# EAGLE design 5Hz_Protoshield_v11 (EAGLE 6.2)
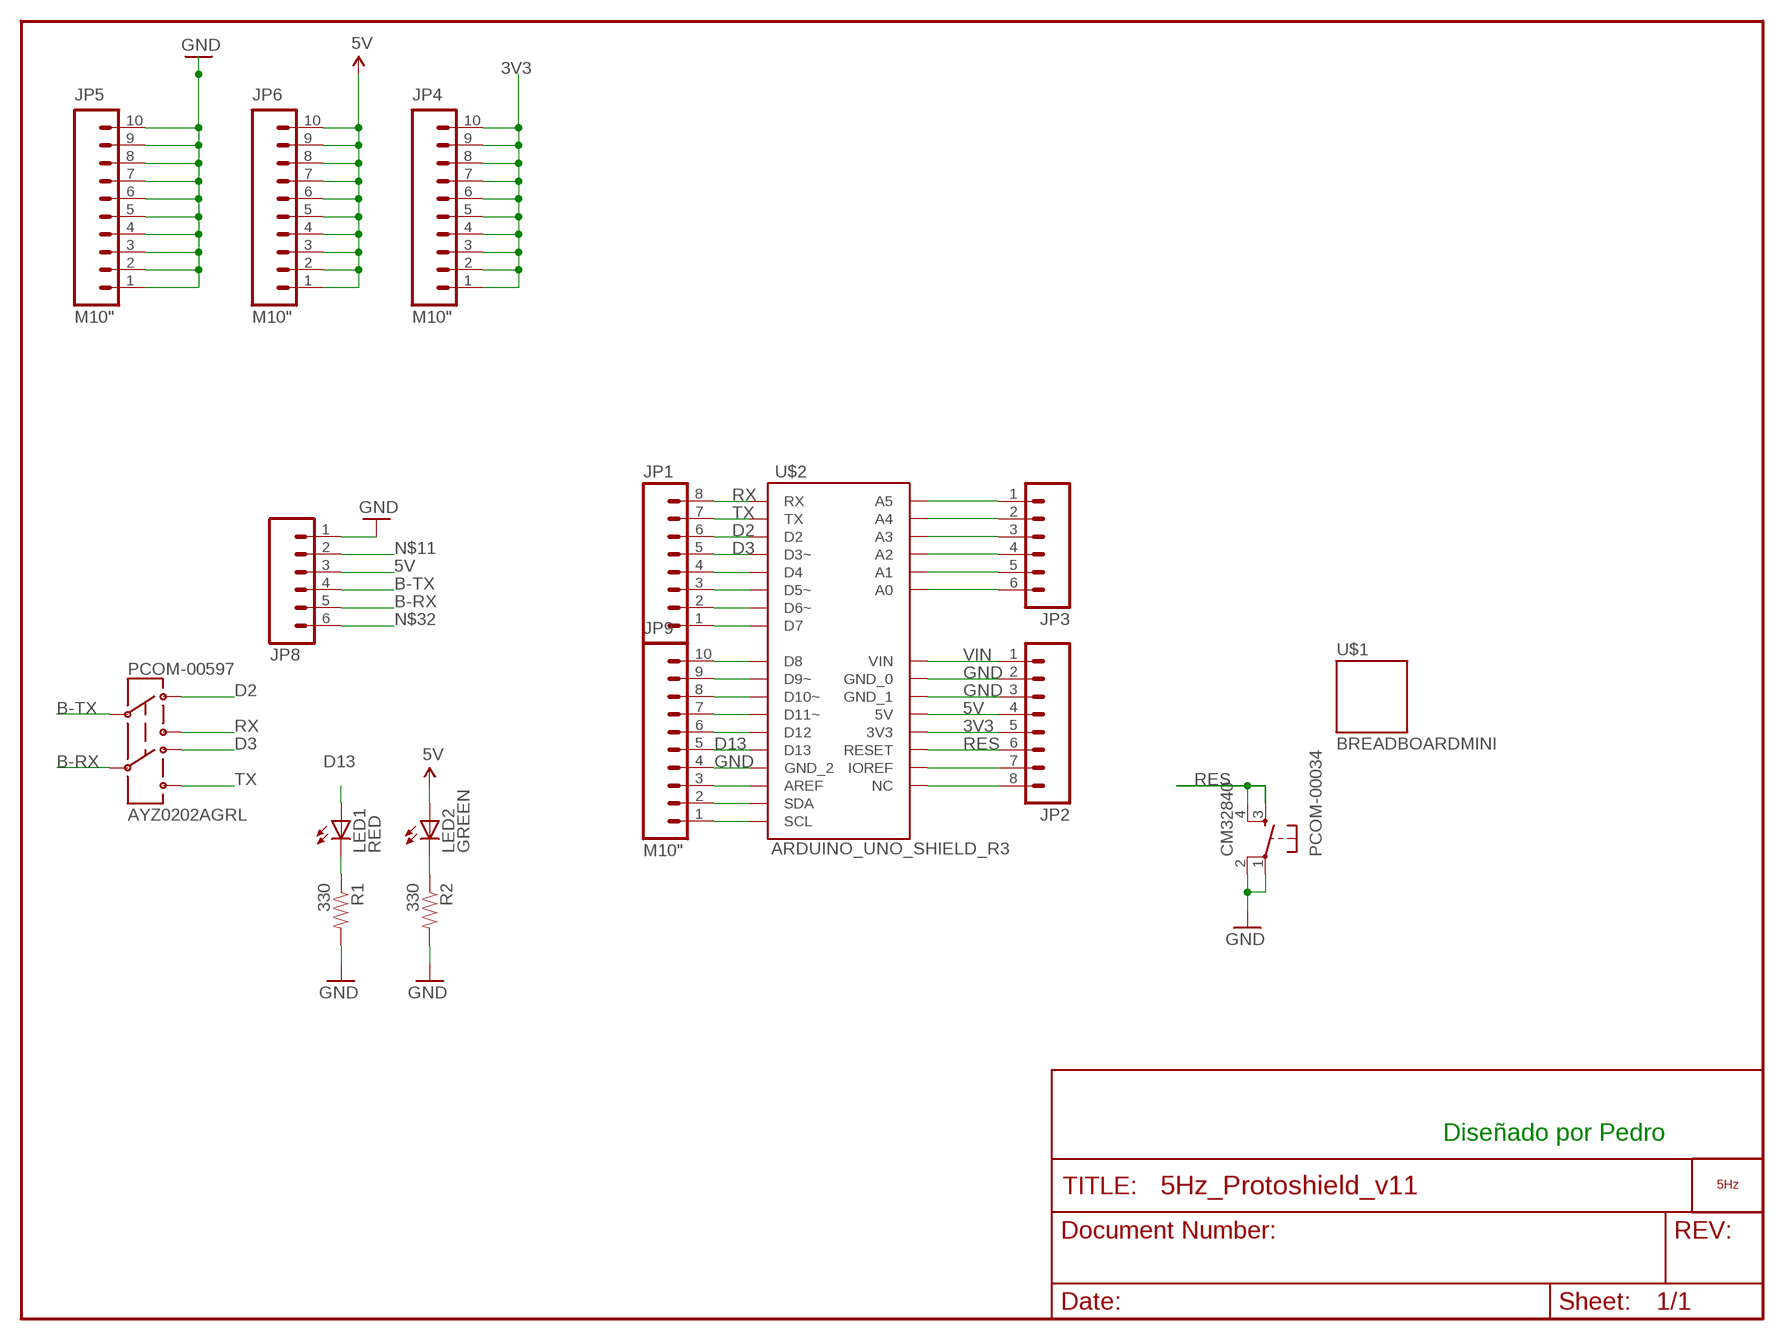
[diagram p0: schematic, sheet 1]

## Parts
JP1  M081X08  [1X08]
JP2  M081X08  [1X08]
JP3  M06SIP  [1X06]
JP4  M10"  [1X10]
JP5  M10"  [1X10]
JP6  M10"  [1X10]
JP8  M06SIP  [1X06]
JP9  M10"  [1X10]
LED1  RED  LED0603  [LED-0603]
LED2  GREEN  LED0603  [LED-0603]
LOGO1  LOGO_5HZ_H_10MM  [5HZ_LOGO_H_10MM]
PCOM-00034  CM32840  TAC_SWITCHSMD  [TACTILE_SWITCH_SMD]
PCOM-00597  AYZ0202AGRL  SWITCH-DPDTSMD  [AYZ0202]
R1  330  RESISTOR0603-RES  [0603-RES]
R2  330  RESISTOR0603-RES  [0603-RES]
U$1  BREADBOARDMINI  [BREADBOARD-MINI]
U$2  ARDUINO_UNO_SHIELD_R3  [UNO_R3_SHIELD_NO_SILK]

## Nets
3V3: JP2.5 JP4.1 JP4.2 JP4.3 JP4.4 JP4.5 JP4.6 JP4.7 JP4.8 JP4.9 JP4.10 U$2.3.3V(3V3)
5V: JP2.4 JP6.1 JP6.2 JP6.3 JP6.4 JP6.5 JP6.6 JP6.7 JP6.8 JP6.9 JP6.10 JP8.3 LED2.A U$2.5V
B-RX: JP8.5 PCOM-00597.5
B-TX: JP8.4 PCOM-00597.2
D2: JP1.6 PCOM-00597.1 U$2.D2
D3: JP1.5 PCOM-00597.4 U$2.D3(D3~)
D13: JP9.5 LED1.A U$2.D13
GND: JP2.2 JP2.3 JP5.1 JP5.2 JP5.3 JP5.4 JP5.5 JP5.6 JP5.7 JP5.8 JP5.9 JP5.10 JP8.1 JP9.4 PCOM-00034.1 PCOM-00034.2 R1.2 R2.2 U$2.GND_0 U$2.GND_1 U$2.GND_2
N$1: JP1.1 U$2.D7
N$2: JP1.2 U$2.D6(D6~)
N$3: JP1.3 U$2.D5(D5~)
N$4: JP1.4 U$2.D4
N$9: JP9.3 U$2.AREF
N$10: LED1.C R1.1
N$11: JP8.2
N$12: JP9.6 U$2.D12
N$13: JP9.7 U$2.D11(D11~)
N$14: JP9.8 U$2.D10(D10~)
N$15: JP9.9 U$2.D9(D9~)
N$16: JP9.10 U$2.D8
N$17: JP3.1 U$2.A5
N$18: JP3.2 U$2.A4
N$19: JP3.3 U$2.A3
N$20: JP3.4 U$2.A2
N$21: JP3.5 U$2.A1
N$22: JP3.6 U$2.A0
N$24: JP9.2 U$2.SDA
N$27: LED2.C R2.1
N$32: JP8.6
N$277: JP9.1 U$2.SCL
N$283: JP2.7 U$2.IOREF
N$284: JP2.8 U$2.NC
RES: JP2.6 PCOM-00034.3 PCOM-00034.4 U$2.RES(RESET)
RX: JP1.8 PCOM-00597.3 U$2.RX
TX: JP1.7 PCOM-00597.6 U$2.TX
VIN: JP2.1 U$2.VIN

## Notes on the sheet
- Diseñado por Pedro

## Library data of the parts
JP1 JP2 = SparkFun:M08: Header 8 Standard 8-pin 0.1" header. Use with straight break away headers (SKU : PRT-00116), right angle break away headers (PRT-00553), swiss pins (PRT-00743), machine pins (PRT-00117), and female headers (PRT-00115).
JP3 JP8 = SparkFun:M06: Header 6 Standard 6-pin 0.1" header. Use with straight break away headers (SKU : PRT-00116), right angle break away headers (PRT-00553), swiss pins (PRT-00743), machine pins (PRT-00117), and female headers (PRT-00115). Molex polarized connector foot print use with SKU : PRT-08094 with associated crimp pins and housings. NOTES ON THE VARIANTS LOCK and LOCK_LONGPADS... This footprint was designed to help hold the alignment of a through-hole component (i.e. 6-pin header) while soldering it into place. You may notice that each hole has been shifted either up or down by 0.005 of an inch from it's more standard position (which is a perfectly straight line). This slight alteration caused the pins (the squares in the middle) to touch the edges of the holes. Because they are alternating, it causes a "brace" to hold the component in place. 0.005 has proven to be the perfect amount of "off-center" position when using our standard breakaway headers. Although looks a little odd when you look at the bare footprint, once you have a header in there, the alteration is very hard to notice. Also, if you push a header all the way into place, it is covered up entirely on the bottom side. This idea of altering the position of holes to aid alignment will be further integrated into the Sparkfun Library for other footprints. It can help hold any component with 3 or more connection pins.
JP4-JP6 JP9 = SparkFun:M10: Header 10 Standard 10-pin 0.1" header. Use with straight break away headers (SKU : PRT-00116), right angle break away headers (PRT-00553), swiss pins (PRT-00743), machine pins (PRT-00117), and female headers (PRT-00115).
LED1 LED2 = SparkFun:LED: LEDs Standard schematic elements and footprints for 5mm, 3mm, 1206, and 0603 sized LEDs. 5mm - Spark Fun Electronics SKU : COM-00529 (and others)
LOGO1 = 5hz-electronica:LOGO_5HZ: Logotipo 5Hz "según Pedro"
PCOM-00034 = SparkFun:TAC_SWITCH: Momentary Switch Button commonly used for reset or general input. Spark Fun Electronics SKU : COM-00097
PCOM-00597 = SparkFun:SWITCH-DPDT: DPDT Version of the COM-00597
R1 R2 = SparkFun:RESISTOR: Resistor Basic schematic elements and footprints for 0603, 1206, and PTH resistors.
U$1 = SparkFun:BREADBOARD: Breadboard Mini Self Adhesive This is the mechnical outline for the very small self adhesive breadboard from SparkFun Electronics. Good for very small proto areas. SKU : PRT-07916
U$2 = 5hz-electronica:ARDUINO_UNO_SHIELD_R3

## Board
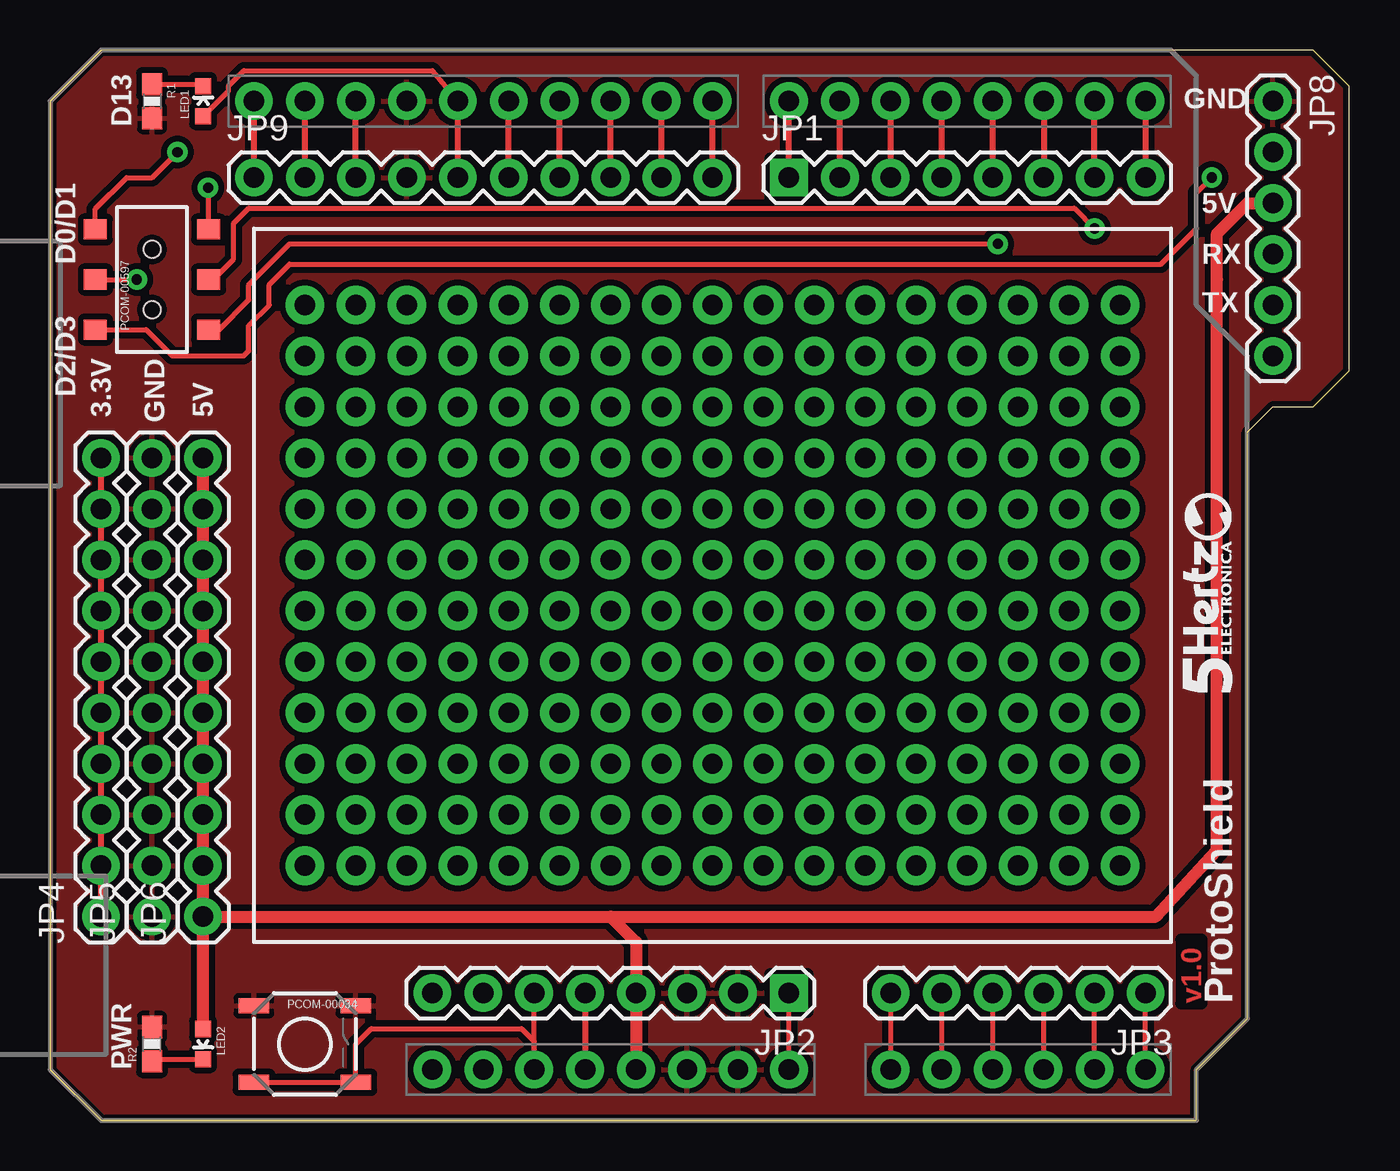
[diagram p1: board, top side]
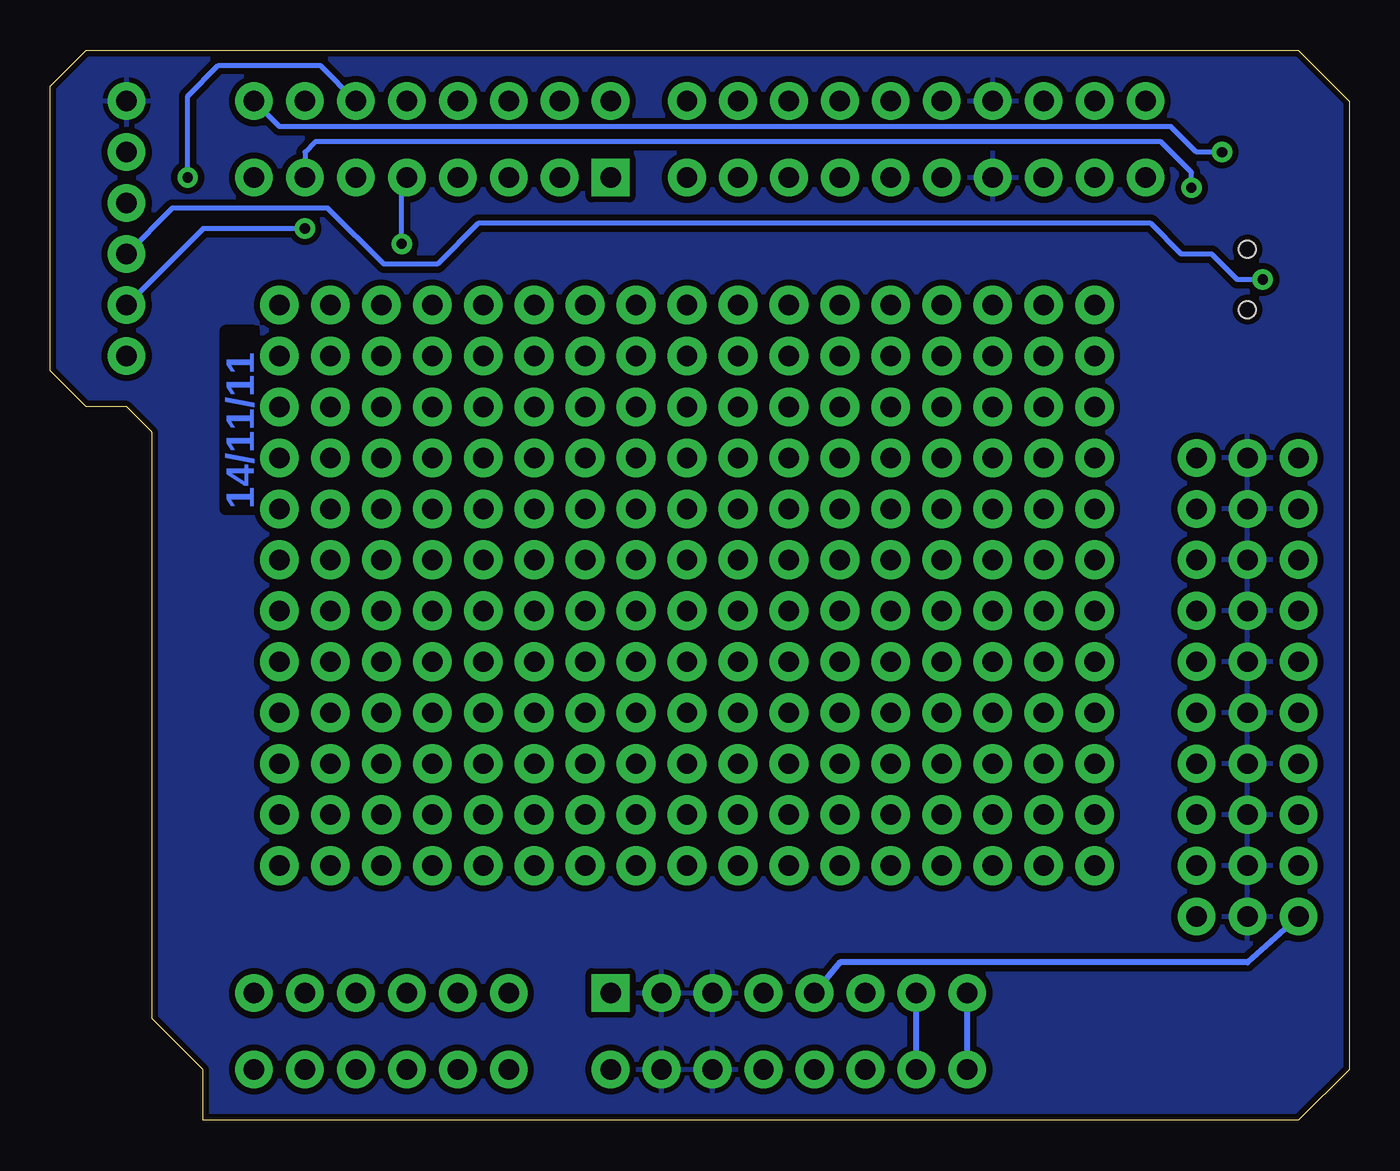
[diagram p2: board, bottom side, seen from below]

Size 64.77 x 53.34 mm. Coordinates in mm from the lower left corner, seen from the top.
Outline: 2.54,0 57.13,0 57.15,2.54 59.69,5.08 59.69,34.29 60.96,35.56 62.97,35.56 64.77,37.36 64.77,51.54 62.97,53.34 2.54,53.34 0,50.8 0,2.54 2.54,0
Copper layers (1*16): Top 0.035mm / dielectric 1.5mm / Bottom 0.035mm
Design rules: minimum track width 8mil, minimum drill 20mil, track to track 8mil, track to pad 8mil, pad to pad 8mil, via to via 8mil, smd to smd 8mil, copper to edge 10mil, drill to drill 8mil, minimum pad ring 12mil, minimum via ring 10mil, stop-mask expansion 4mil, vias tented up to drill 25mil, thermal gap 10mil

### Footprints (pad centres in the part's own frame; a part is rotated, then mirrored left to right if it is on the bottom)
1X08 = drill 1.016 pad 1.88 square: 1 0,0 | drill 1.016 pad 1.88: 2 2.54,0; 3 5.08,0; 4 7.62,0; 5 10.16,0; 6 12.7,0; 7 15.24,0; 8 17.78,0
1X06 = drill 1.016 pad 1.88: 1 0,0; 2 2.54,0; 3 5.08,0; 4 7.62,0; 5 10.16,0; 6 12.7,0
1X10 = drill 1.016 pad 1.88: 1 0,0; 2 2.54,0; 3 5.08,0; 4 7.62,0; 5 10.16,0; 6 12.7,0; 7 15.24,0; 8 17.78,0; 9 20.32,0; 10 22.86,0
LED-0603 = smd 0.8 x 0.8: A 0,-0.75; C 0,0.75
TACTILE_SWITCH_SMD = smd 1.524 x 0.762: 1 -2.54,1.905; 2 2.54,1.905; 3 -2.54,-1.905; 4 2.54,-1.905
AYZ0202 = smd 1 x 1.15: 1 -2.5,2.825; 2 0,2.825; 3 2.5,2.825; 4 -2.5,-2.825; 5 0,-2.825; 6 2.5,-2.825 | hole 0.85: 1.5,0; -1.5,0
0603-RES = smd 1.1 x 1: 1 -0.85,0; 2 0.85,0
UNO_R3_SHIELD_NO_SILK = drill 1.016 pad 1.88: 3.3V 26.67,2.54; 5V 29.21,2.54; A0 41.91,2.54; A1 44.45,2.54; A2 46.99,2.54; A3 49.53,2.54; A4 52.07,2.54; A5 54.61,2.54; AREF 15.24,50.8; D2 49.53,50.8; D3 46.99,50.8; D4 44.45,50.8; D5 41.91,50.8; D6 39.37,50.8; D7 36.83,50.8; D8 33.02,50.8; D9 30.48,50.8; D10 27.94,50.8; D11 25.4,50.8; D12 22.86,50.8; D13 20.32,50.8; GND_0 34.29,2.54; GND_1 31.75,2.54; GND_2 17.78,50.8; IOREF 21.59,2.54; NC 19.05,2.54; RES 24.13,2.54; RX 54.61,50.8; SCL 10.16,50.8; SDA 12.7,50.8; TX 52.07,50.8; VIN 36.83,2.54

### Placement (x,y rotation side)
JP1  36.83,46.99 0 top
JP2  36.83,6.35 180 top
JP3  54.61,6.35 180 top
JP4  2.54,10.16 90 top
JP5  5.08,10.16 90 top
JP6  7.62,10.16 90 top
JP8  60.96,50.8 270 top
JP9  10.16,46.99 0 top
LED1  7.62,50.8 0 top
LED2  7.62,3.81 180 top
LOGO1  58.93,21.34 90 top
PCOM-00034  12.7,3.81 0 top
PCOM-00597  5.08,41.91 90 top
R1  5.08,50.8 270 top
R2  5.08,3.81 90 top
U$1  10.16,8.89 0 top
U$2  0,0 0 top

### Tracks (layer width: path | path; a pad name or v marks a point on that pad's centre or on a via)
3V3
  Top 0.305: JP4.10 JP4.9 JP4.8 JP4.7 JP4.6 JP4.5 JP4.4 JP4.3 JP4.2 JP4.1 | JP2.5 U$2.3.3V
  Bottom 0.305: JP4.1 5.08,7.87 25.4,7.87 JP2.5
5V
  Top 0.61: LED2.A JP6.1 | JP6.1 JP6.2 JP6.3 JP6.4 JP6.5 JP6.6 JP6.7 JP6.8 JP6.9 JP6.10 | 27.94,10.16 29.21,8.89 JP2.4 U$2.5V | JP6.1 27.94,10.16 | 27.94,10.16 55.12,10.16 58.17,13.46 58.17,41.91 58.17,44.2 59.69,45.72 JP8.3
B-RX  (via drill 0.51)
  Top 0.254: PCOM-00597.5 8.13,41.91 9.14,42.93 9.14,44.7 9.91,45.47 51.05,45.47 v52.07,44.45
  Bottom 0.254: v52.07,44.45 57.15,44.45 JP8.5
B-TX  (via drill 0.51)
  Top 0.254: PCOM-00597.2 v4.32,41.91
  Bottom 0.254: v4.32,41.91 5.59,41.91 6.86,43.18 8.38,43.18 9.91,44.7 43.43,44.7 45.47,42.67 48.13,42.67 50.93,45.47 58.67,45.47 JP8.4
D2  (via drill 0.51)
  Top 0.254: PCOM-00597.1 4.79,39.41 6.1,38.1 9.65,38.1 9.91,38.35 9.91,39.62 10.92,40.64 10.92,41.66 11.94,42.67 55.37,42.67 57.15,44.45 57.15,46.23 v57.91,46.99
  Top 0.305: U$2.D2 JP1.6
  Bottom 0.254: v57.91,46.99 57.91,51.05 56.39,52.58 51.31,52.58 U$2.D2
D3  (via drill 0.51)
  Top 0.254: PCOM-00597.4 8.42,39.41 9.91,40.89 9.91,41.66 11.94,43.69 v47.24,43.69
  Top 0.305: JP1.5 U$2.D3
  Bottom 0.254: v47.24,43.69 47.24,46.74 JP1.5
D13
  Top 0.254: 7.62,50.29 LED1.A 8.37,50.8 8.38,50.8 8.89,51.31 8.89,51.56 9.65,52.32 19.05,52.32 U$2.D13
  Top 0.305: U$2.D13 JP9.5
GND
  pour Bottom (isolate 0.305): 0,50.8 0,2.54 2.54,0 57.15,0 57.15,2.54 59.69,5.08 59.69,34.29 60.96,35.56 62.97,35.56 64.77,37.36 64.77,51.54 62.97,53.34 2.54,53.34
  pour Top (isolate 0.305): 0,50.8 0,2.54 2.54,0 57.15,0 57.15,2.54 59.69,5.08 59.69,34.29 60.96,35.56 62.97,35.56 64.77,37.36 64.77,51.54 62.97,53.34 2.54,53.34
N$1
  Top 0.305: JP1.1 U$2.D7
N$2
  Top 0.305: JP1.2 U$2.D6
N$3
  Top 0.305: JP1.3 U$2.D5
N$4
  Top 0.305: JP1.4 U$2.D4
N$9
  Top 0.305: JP9.3 U$2.AREF
N$10
  Top 0.254: R1.1 7.52,51.65 LED1.C
N$12
  Top 0.305: JP9.6 U$2.D12
N$13
  Top 0.305: JP9.7 U$2.D11
N$14
  Top 0.305: JP9.8 U$2.D10
N$15
  Top 0.305: JP9.9 U$2.D9
N$16
  Top 0.305: JP9.10 U$2.D8
N$17
  Top 0.254: U$2.A5 JP3.1
N$18
  Top 0.254: U$2.A4 JP3.2
N$19
  Top 0.254: U$2.A3 JP3.3
N$20
  Top 0.254: U$2.A2 JP3.4
N$21
  Top 0.254: U$2.A1 JP3.5
N$22
  Top 0.254: U$2.A0 JP3.6
N$23  (via drill 1.02 pad 1.93)
  other vias: 20.32,40.64
N$24
  Top 0.305: JP9.2 U$2.SDA
N$25  (via drill 1.02 pad 1.93)
  other vias: 20.32,38.1
N$26  (via drill 1.02 pad 1.93)
  other vias: 20.32,35.56
N$27
  Top 0.254: R2.1 5.18,3.06 LED2.C
N$28  (via drill 1.02 pad 1.93)
  other vias: 20.32,33.02
N$77  (via drill 1.02 pad 1.93)
  other vias: 53.34,40.64
N$78  (via drill 1.02 pad 1.93)
  other vias: 53.34,38.1
N$79  (via drill 1.02 pad 1.93)
  other vias: 53.34,35.56
N$80  (via drill 1.02 pad 1.93)
  other vias: 53.34,33.02
N$81  (via drill 1.02 pad 1.93)
  other vias: 53.34,30.48
N$82  (via drill 1.02 pad 1.93)
  other vias: 53.34,27.94
N$83  (via drill 1.02 pad 1.93)
  other vias: 53.34,25.4
N$84  (via drill 1.02 pad 1.93)
  other vias: 53.34,22.86
N$85  (via drill 1.02 pad 1.93)
  other vias: 53.34,20.32
N$86  (via drill 1.02 pad 1.93)
  other vias: 53.34,17.78
N$87  (via drill 1.02 pad 1.93)
  other vias: 53.34,15.24
N$88  (via drill 1.02 pad 1.93)
  other vias: 53.34,12.7
N$89  (via drill 1.02 pad 1.93)
  other vias: 50.8,40.64
N$90  (via drill 1.02 pad 1.93)
  other vias: 50.8,38.1
N$91  (via drill 1.02 pad 1.93)
  other vias: 50.8,35.56
N$92  (via drill 1.02 pad 1.93)
  other vias: 50.8,33.02
N$93  (via drill 1.02 pad 1.93)
  other vias: 50.8,30.48
N$94  (via drill 1.02 pad 1.93)
  other vias: 50.8,27.94
N$95  (via drill 1.02 pad 1.93)
  other vias: 50.8,25.4
N$96  (via drill 1.02 pad 1.93)
  other vias: 50.8,22.86
N$97  (via drill 1.02 pad 1.93)
  other vias: 50.8,20.32
N$98  (via drill 1.02 pad 1.93)
  other vias: 50.8,17.78
N$99  (via drill 1.02 pad 1.93)
  other vias: 50.8,15.24
N$100  (via drill 1.02 pad 1.93)
  other vias: 50.8,12.7
N$101  (via drill 1.02 pad 1.93)
  other vias: 48.26,40.64
N$102  (via drill 1.02 pad 1.93)
  other vias: 48.26,38.1
N$103  (via drill 1.02 pad 1.93)
  other vias: 48.26,35.56
N$104  (via drill 1.02 pad 1.93)
  other vias: 48.26,33.02
N$105  (via drill 1.02 pad 1.93)
  other vias: 48.26,30.48
N$106  (via drill 1.02 pad 1.93)
  other vias: 48.26,27.94
N$107  (via drill 1.02 pad 1.93)
  other vias: 48.26,25.4
N$108  (via drill 1.02 pad 1.93)
  other vias: 48.26,22.86
N$109  (via drill 1.02 pad 1.93)
  other vias: 48.26,20.32
N$110  (via drill 1.02 pad 1.93)
  other vias: 48.26,17.78
N$111  (via drill 1.02 pad 1.93)
  other vias: 48.26,15.24
N$112  (via drill 1.02 pad 1.93)
  other vias: 48.26,12.7
N$113  (via drill 1.02 pad 1.93)
  other vias: 45.72,40.64
N$114  (via drill 1.02 pad 1.93)
  other vias: 45.72,38.1
N$115  (via drill 1.02 pad 1.93)
  other vias: 45.72,35.56
N$116  (via drill 1.02 pad 1.93)
  other vias: 45.72,33.02
N$117  (via drill 1.02 pad 1.93)
  other vias: 45.72,30.48
N$118  (via drill 1.02 pad 1.93)
  other vias: 45.72,27.94
N$119  (via drill 1.02 pad 1.93)
  other vias: 45.72,25.4
N$120  (via drill 1.02 pad 1.93)
  other vias: 45.72,22.86
N$121  (via drill 1.02 pad 1.93)
  other vias: 45.72,20.32
N$122  (via drill 1.02 pad 1.93)
  other vias: 45.72,17.78
N$123  (via drill 1.02 pad 1.93)
  other vias: 45.72,15.24
N$124  (via drill 1.02 pad 1.93)
  other vias: 45.72,12.7
N$125  (via drill 1.02 pad 1.93)
  other vias: 43.18,40.64
N$126  (via drill 1.02 pad 1.93)
  other vias: 43.18,38.1
N$127  (via drill 1.02 pad 1.93)
  other vias: 43.18,35.56
N$128  (via drill 1.02 pad 1.93)
  other vias: 43.18,33.02
N$129  (via drill 1.02 pad 1.93)
  other vias: 43.18,30.48
N$130  (via drill 1.02 pad 1.93)
  other vias: 43.18,27.94
N$131  (via drill 1.02 pad 1.93)
  other vias: 43.18,25.4
N$132  (via drill 1.02 pad 1.93)
  other vias: 43.18,22.86
N$133  (via drill 1.02 pad 1.93)
  other vias: 43.18,20.32
N$134  (via drill 1.02 pad 1.93)
  other vias: 43.18,17.78
N$135  (via drill 1.02 pad 1.93)
  other vias: 43.18,15.24
N$136  (via drill 1.02 pad 1.93)
  other vias: 43.18,12.7
N$137  (via drill 1.02 pad 1.93)
  other vias: 40.64,40.64
N$138  (via drill 1.02 pad 1.93)
  other vias: 40.64,38.1
N$139  (via drill 1.02 pad 1.93)
  other vias: 40.64,35.56
N$140  (via drill 1.02 pad 1.93)
  other vias: 40.64,33.02
N$141  (via drill 1.02 pad 1.93)
  other vias: 40.64,30.48
N$142  (via drill 1.02 pad 1.93)
  other vias: 40.64,27.94
N$143  (via drill 1.02 pad 1.93)
  other vias: 40.64,25.4
N$144  (via drill 1.02 pad 1.93)
  other vias: 40.64,22.86
N$145  (via drill 1.02 pad 1.93)
  other vias: 40.64,20.32
N$146  (via drill 1.02 pad 1.93)
  other vias: 40.64,17.78
N$147  (via drill 1.02 pad 1.93)
  other vias: 40.64,15.24
N$148  (via drill 1.02 pad 1.93)
  other vias: 40.64,12.7
N$149  (via drill 1.02 pad 1.93)
  other vias: 38.1,40.64
N$150  (via drill 1.02 pad 1.93)
  other vias: 38.1,38.1
N$151  (via drill 1.02 pad 1.93)
  other vias: 38.1,35.56
N$152  (via drill 1.02 pad 1.93)
  other vias: 38.1,33.02
N$153  (via drill 1.02 pad 1.93)
  other vias: 38.1,30.48
N$154  (via drill 1.02 pad 1.93)
  other vias: 38.1,27.94
N$155  (via drill 1.02 pad 1.93)
  other vias: 38.1,25.4
N$156  (via drill 1.02 pad 1.93)
  other vias: 38.1,22.86
N$157  (via drill 1.02 pad 1.93)
  other vias: 38.1,20.32
N$158  (via drill 1.02 pad 1.93)
  other vias: 38.1,17.78
N$159  (via drill 1.02 pad 1.93)
  other vias: 38.1,15.24
N$160  (via drill 1.02 pad 1.93)
  other vias: 38.1,12.7
N$161  (via drill 1.02 pad 1.93)
  other vias: 35.56,40.64
N$162  (via drill 1.02 pad 1.93)
  other vias: 35.56,38.1
N$163  (via drill 1.02 pad 1.93)
  other vias: 35.56,35.56
N$164  (via drill 1.02 pad 1.93)
  other vias: 35.56,33.02
N$165  (via drill 1.02 pad 1.93)
  other vias: 35.56,30.48
N$166  (via drill 1.02 pad 1.93)
  other vias: 35.56,27.94
N$167  (via drill 1.02 pad 1.93)
  other vias: 35.56,25.4
N$168  (via drill 1.02 pad 1.93)
  other vias: 35.56,22.86
N$169  (via drill 1.02 pad 1.93)
  other vias: 35.56,20.32
N$170  (via drill 1.02 pad 1.93)
  other vias: 35.56,17.78
N$171  (via drill 1.02 pad 1.93)
  other vias: 35.56,15.24
N$172  (via drill 1.02 pad 1.93)
  other vias: 35.56,12.7
N$173  (via drill 1.02 pad 1.93)
  other vias: 33.02,40.64
N$174  (via drill 1.02 pad 1.93)
  other vias: 33.02,38.1
N$175  (via drill 1.02 pad 1.93)
  other vias: 33.02,35.56
N$176  (via drill 1.02 pad 1.93)
  other vias: 33.02,33.02
N$177  (via drill 1.02 pad 1.93)
  other vias: 33.02,30.48
N$178  (via drill 1.02 pad 1.93)
  other vias: 33.02,27.94
N$179  (via drill 1.02 pad 1.93)
  other vias: 33.02,25.4
N$180  (via drill 1.02 pad 1.93)
  other vias: 33.02,22.86
N$181  (via drill 1.02 pad 1.93)
  other vias: 33.02,20.32
N$182  (via drill 1.02 pad 1.93)
  other vias: 33.02,17.78
N$183  (via drill 1.02 pad 1.93)
  other vias: 33.02,15.24
N$184  (via drill 1.02 pad 1.93)
  other vias: 33.02,12.7
N$185  (via drill 1.02 pad 1.93)
  other vias: 30.48,40.64
N$186  (via drill 1.02 pad 1.93)
  other vias: 30.48,38.1
N$187  (via drill 1.02 pad 1.93)
  other vias: 30.48,35.56
N$188  (via drill 1.02 pad 1.93)
  other vias: 30.48,33.02
N$189  (via drill 1.02 pad 1.93)
  other vias: 30.48,30.48
N$190  (via drill 1.02 pad 1.93)
  other vias: 30.48,27.94
N$191  (via drill 1.02 pad 1.93)
  other vias: 30.48,25.4
N$192  (via drill 1.02 pad 1.93)
  other vias: 30.48,22.86
N$193  (via drill 1.02 pad 1.93)
  other vias: 30.48,20.32
N$194  (via drill 1.02 pad 1.93)
  other vias: 30.48,17.78
N$195  (via drill 1.02 pad 1.93)
  other vias: 30.48,15.24
N$196  (via drill 1.02 pad 1.93)
  other vias: 30.48,12.7
N$197  (via drill 1.02 pad 1.93)
  other vias: 27.94,40.64
N$198  (via drill 1.02 pad 1.93)
  other vias: 27.94,38.1
N$199  (via drill 1.02 pad 1.93)
  other vias: 27.94,35.56
N$200  (via drill 1.02 pad 1.93)
  other vias: 27.94,33.02
N$201  (via drill 1.02 pad 1.93)
  other vias: 27.94,30.48
N$202  (via drill 1.02 pad 1.93)
  other vias: 27.94,27.94
N$203  (via drill 1.02 pad 1.93)
  other vias: 27.94,25.4
N$204  (via drill 1.02 pad 1.93)
  other vias: 27.94,22.86
N$205  (via drill 1.02 pad 1.93)
  other vias: 27.94,20.32
N$206  (via drill 1.02 pad 1.93)
  other vias: 27.94,17.78
N$207  (via drill 1.02 pad 1.93)
  other vias: 27.94,15.24
N$208  (via drill 1.02 pad 1.93)
  other vias: 27.94,12.7
N$209  (via drill 1.02 pad 1.93)
  other vias: 25.4,40.64
N$210  (via drill 1.02 pad 1.93)
  other vias: 25.4,38.1
N$211  (via drill 1.02 pad 1.93)
  other vias: 25.4,35.56
N$212  (via drill 1.02 pad 1.93)
  other vias: 25.4,33.02
N$213  (via drill 1.02 pad 1.93)
  other vias: 25.4,30.48
N$214  (via drill 1.02 pad 1.93)
  other vias: 25.4,27.94
N$215  (via drill 1.02 pad 1.93)
  other vias: 25.4,25.4
N$216  (via drill 1.02 pad 1.93)
  other vias: 25.4,22.86
N$217  (via drill 1.02 pad 1.93)
  other vias: 25.4,20.32
N$218  (via drill 1.02 pad 1.93)
  other vias: 25.4,17.78
N$219  (via drill 1.02 pad 1.93)
  other vias: 25.4,15.24
N$220  (via drill 1.02 pad 1.93)
  other vias: 25.4,12.7
N$221  (via drill 1.02 pad 1.93)
  other vias: 22.86,40.64
N$222  (via drill 1.02 pad 1.93)
  other vias: 22.86,38.1
N$223  (via drill 1.02 pad 1.93)
  other vias: 22.86,35.56
N$224  (via drill 1.02 pad 1.93)
  other vias: 22.86,33.02
N$225  (via drill 1.02 pad 1.93)
  other vias: 22.86,30.48
N$226  (via drill 1.02 pad 1.93)
  other vias: 22.86,27.94
N$227  (via drill 1.02 pad 1.93)
  other vias: 22.86,25.4
N$228  (via drill 1.02 pad 1.93)
  other vias: 22.86,22.86
N$229  (via drill 1.02 pad 1.93)
  other vias: 22.86,20.32
N$230  (via drill 1.02 pad 1.93)
  other vias: 22.86,17.78
N$231  (via drill 1.02 pad 1.93)
  other vias: 22.86,15.24
N$232  (via drill 1.02 pad 1.93)
  other vias: 22.86,12.7
N$233  (via drill 1.02 pad 1.93)
  other vias: 20.32,30.48
N$234  (via drill 1.02 pad 1.93)
  other vias: 20.32,27.94
N$235  (via drill 1.02 pad 1.93)
  other vias: 20.32,25.4
N$236  (via drill 1.02 pad 1.93)
  other vias: 20.32,22.86
N$237  (via drill 1.02 pad 1.93)
  other vias: 20.32,20.32
N$238  (via drill 1.02 pad 1.93)
  other vias: 20.32,17.78
N$239  (via drill 1.02 pad 1.93)
  other vias: 20.32,15.24
N$240  (via drill 1.02 pad 1.93)
  other vias: 20.32,12.7
N$241  (via drill 1.02 pad 1.93)
  other vias: 17.78,40.64
N$242  (via drill 1.02 pad 1.93)
  other vias: 17.78,38.1
N$243  (via drill 1.02 pad 1.93)
  other vias: 17.78,35.56
N$244  (via drill 1.02 pad 1.93)
  other vias: 17.78,33.02
N$245  (via drill 1.02 pad 1.93)
  other vias: 17.78,30.48
N$246  (via drill 1.02 pad 1.93)
  other vias: 17.78,27.94
N$247  (via drill 1.02 pad 1.93)
  other vias: 17.78,25.4
N$248  (via drill 1.02 pad 1.93)
  other vias: 17.78,22.86
N$249  (via drill 1.02 pad 1.93)
  other vias: 17.78,20.32
N$250  (via drill 1.02 pad 1.93)
  other vias: 17.78,17.78
N$251  (via drill 1.02 pad 1.93)
  other vias: 17.78,15.24
N$252  (via drill 1.02 pad 1.93)
  other vias: 17.78,12.7
N$253  (via drill 1.02 pad 1.93)
  other vias: 15.24,40.64
N$254  (via drill 1.02 pad 1.93)
  other vias: 15.24,38.1
N$255  (via drill 1.02 pad 1.93)
  other vias: 15.24,35.56
N$256  (via drill 1.02 pad 1.93)
  other vias: 15.24,33.02
N$257  (via drill 1.02 pad 1.93)
  other vias: 15.24,30.48
N$258  (via drill 1.02 pad 1.93)
  other vias: 15.24,27.94
N$259  (via drill 1.02 pad 1.93)
  other vias: 15.24,25.4
N$260  (via drill 1.02 pad 1.93)
  other vias: 15.24,22.86
N$261  (via drill 1.02 pad 1.93)
  other vias: 15.24,20.32
N$262  (via drill 1.02 pad 1.93)
  other vias: 15.24,17.78
N$263  (via drill 1.02 pad 1.93)
  other vias: 15.24,15.24
N$264  (via drill 1.02 pad 1.93)
  other vias: 15.24,12.7
N$265  (via drill 1.02 pad 1.93)
  other vias: 12.7,40.64
N$266  (via drill 1.02 pad 1.93)
  other vias: 12.7,38.1
N$267  (via drill 1.02 pad 1.93)
  other vias: 12.7,35.56
N$268  (via drill 1.02 pad 1.93)
  other vias: 12.7,33.02
N$269  (via drill 1.02 pad 1.93)
  other vias: 12.7,30.48
N$270  (via drill 1.02 pad 1.93)
  other vias: 12.7,27.94
N$271  (via drill 1.02 pad 1.93)
  other vias: 12.7,25.4
N$272  (via drill 1.02 pad 1.93)
  other vias: 12.7,22.86
N$273  (via drill 1.02 pad 1.93)
  other vias: 12.7,20.32
N$274  (via drill 1.02 pad 1.93)
  other vias: 12.7,17.78
N$275  (via drill 1.02 pad 1.93)
  other vias: 12.7,15.24
N$276  (via drill 1.02 pad 1.93)
  other vias: 12.7,12.7
N$277
  Top 0.305: JP9.1 U$2.SCL
N$283
  Bottom 0.305: U$2.IOREF JP2.7
N$284
  Bottom 0.305: U$2.NC JP2.8
RES
  Top 0.254: JP2.6 U$2.RES 24.13,3.94 23.5,4.57 16,4.57 15.24,3.81 PCOM-00034.4 PCOM-00034.3
RX  (via drill 0.51)
  Top 0.254: PCOM-00597.3 2.25,45.44 3.81,46.99 5.08,46.99 v6.35,48.26
  Top 0.305: U$2.RX JP1.8
  Bottom 0.254: v6.35,48.26 7.62,48.26 8.89,49.53 53.34,49.53 U$2.RX
TX  (via drill 0.51)
  Top 0.254: PCOM-00597.6 7.91,46.45 v7.87,46.48
  Top 0.305: JP1.7 U$2.TX
  Bottom 0.254: v7.87,46.48 7.87,47.24 9.4,48.77 51.56,48.77 52.07,48.26 JP1.7
VIN
  Top 0.254: U$2.VIN JP2.1

### Text on the board
Top: v1.0
Bottom: 14/11/11
tPlace: D13 | GND | 5V | D0/D1 | RX | TX | D2/D3 | 3.3V | GND | 5V | ProtoShield | PWR